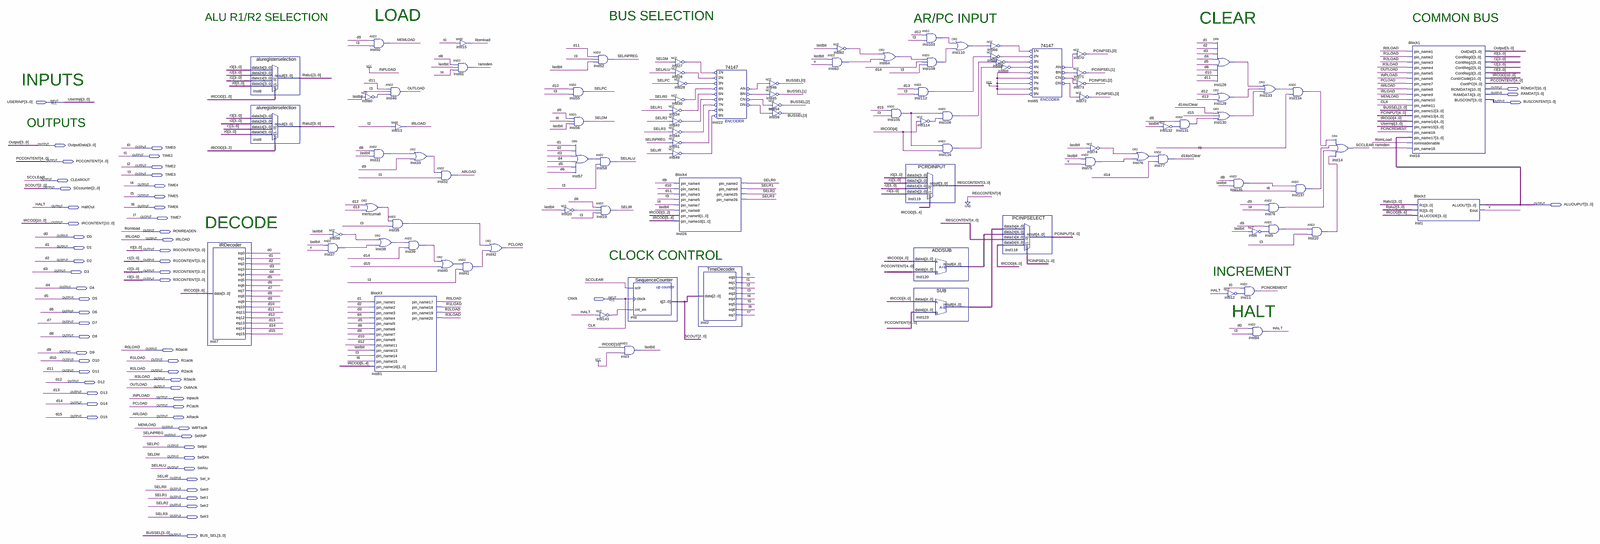
[diagram p0: schematic sheet, whole]
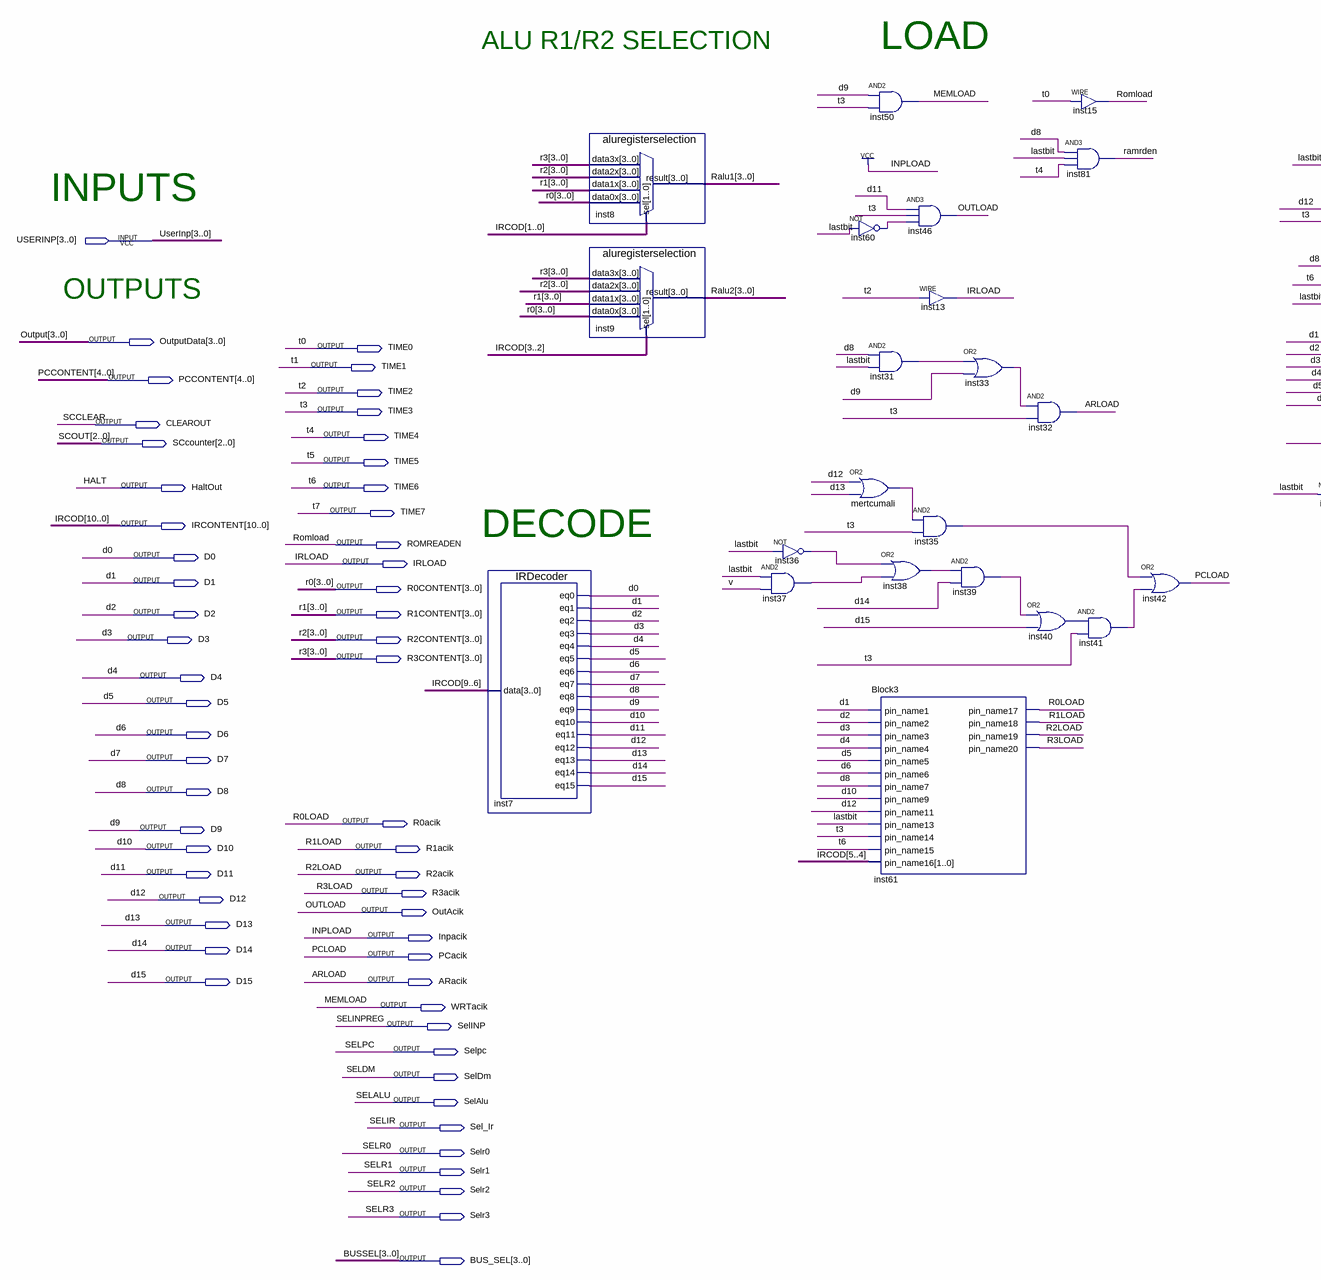
[diagram p1: schematic sheet, left part]
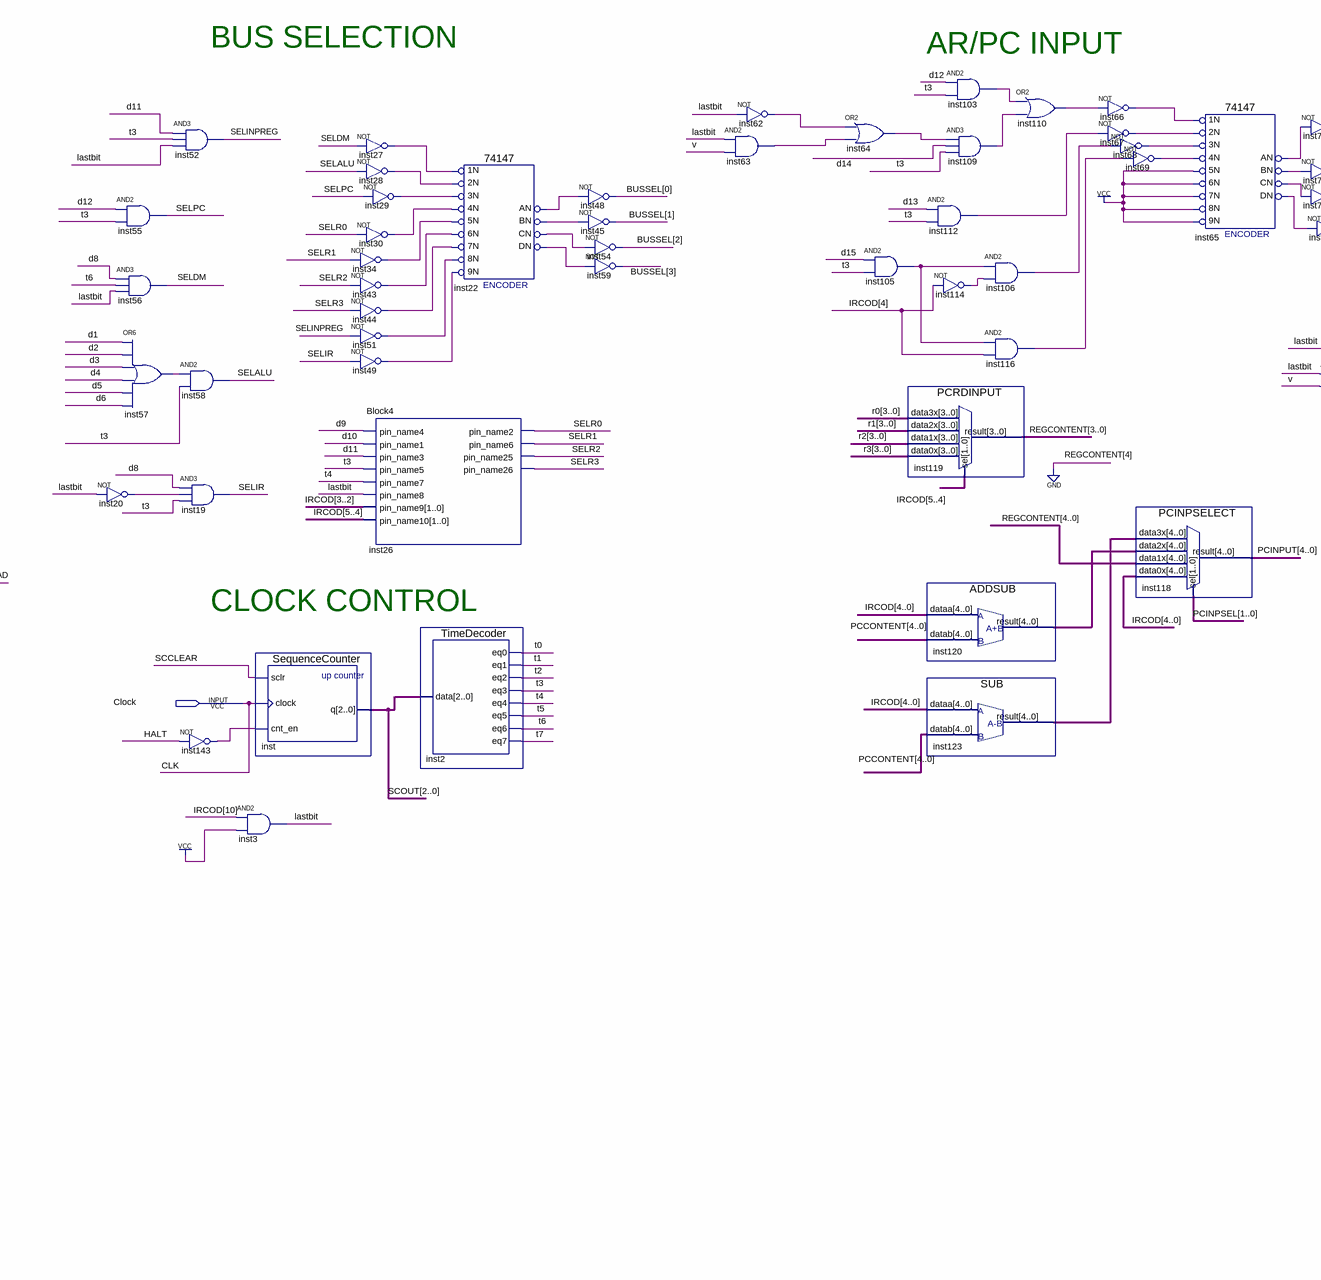
[diagram p2: schematic sheet, centre part]
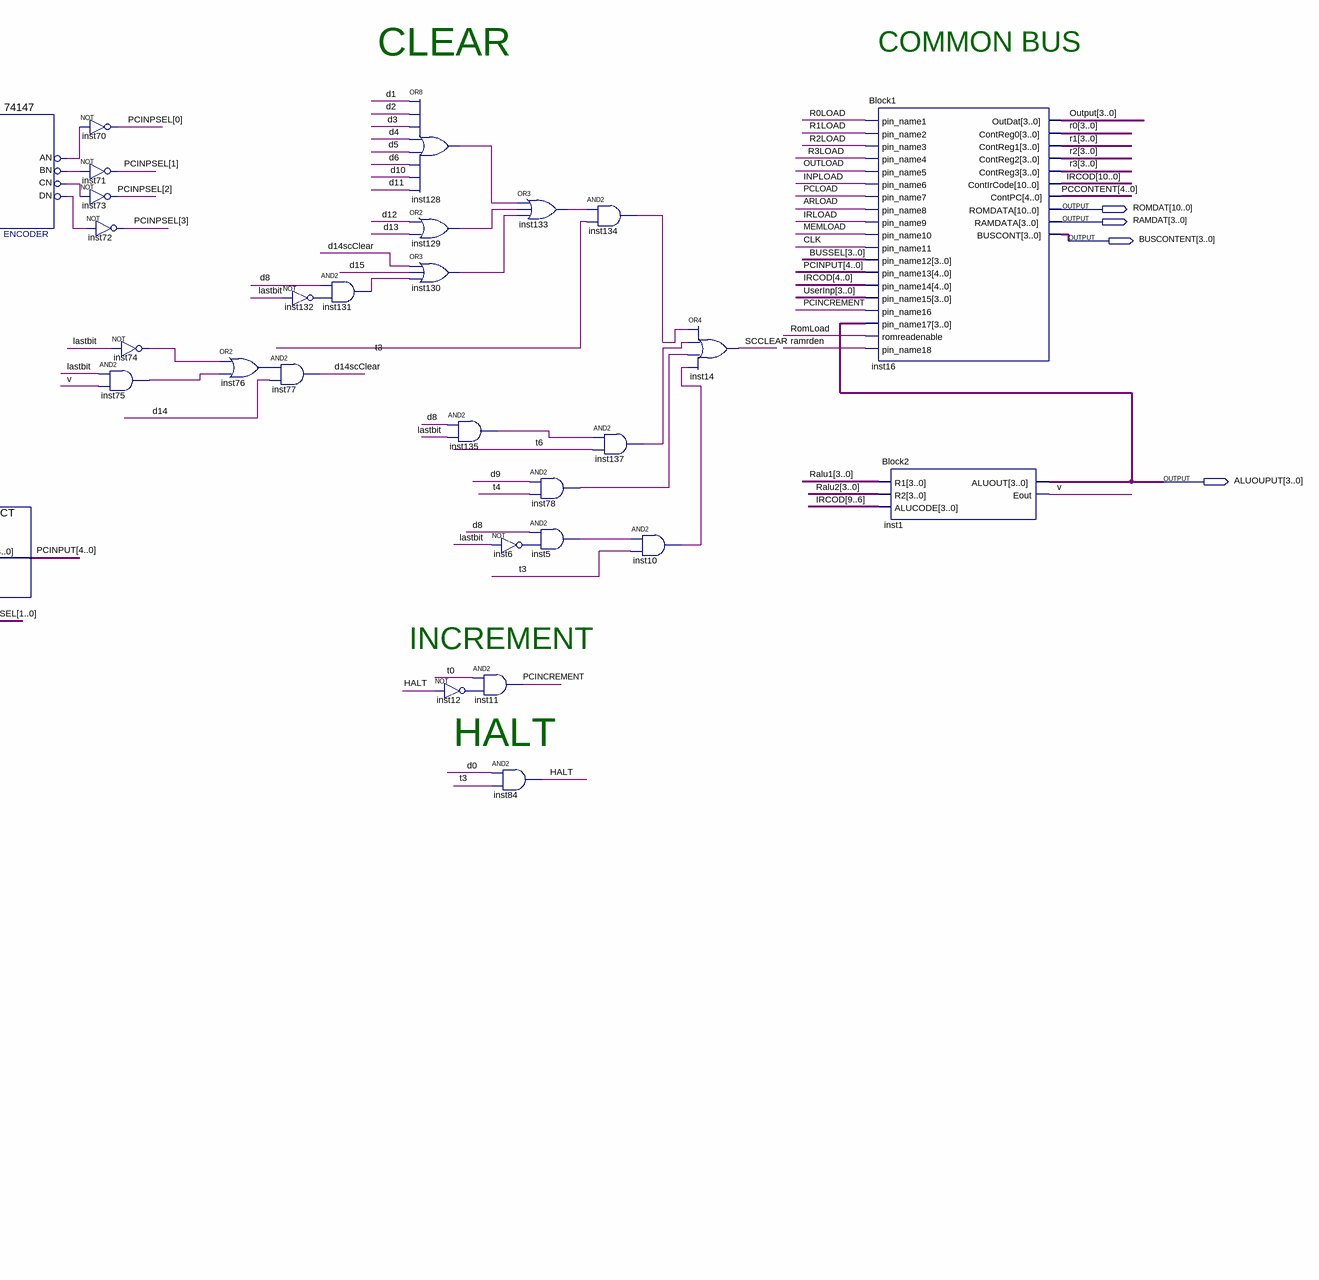
[diagram p3: schematic sheet, right part]
// Quartus schematic ControlUnit.bdf as structural Verilog: 95 symbols, 61 pins
module ControlUnit (
  input  [3:0] USERINP,
  input  Clock,
  output [10:0] ROMDAT,
  output [3:0] RAMDAT,
  output [3:0] BUSCONTENT,
  output [3:0] OutputData,
  output TIME0,
  output TIME1,
  output [4:0] PCCONTENT,
  output TIME2,
  output TIME3,
  output CLEAROUT,
  output TIME4,
  output [2:0] SCcounter,
  output TIME5,
  output [3:0] ALUOUPUT,
  output HaltOut,
  output TIME6,
  output TIME7,
  output [10:0] IRCONTENT,
  output ROMREADEN,
  output D0,
  output IRLOAD,
  output D1,
  output [3:0] R0CONTENT,
  output D2,
  output [3:0] R1CONTENT,
  output D3,
  output [3:0] R2CONTENT,
  output [3:0] R3CONTENT,
  output D4,
  output D5,
  output D6,
  output D7,
  output D8,
  output R0acik,
  output D9,
  output D10,
  output R1acik,
  output D11,
  output R2acik,
  output R3acik,
  output D12,
  output OutAcik,
  output D13,
  output Inpacik,
  output D14,
  output PCacik,
  output D15,
  output ARacik,
  output WRTacik,
  output SelINP,
  output Selpc,
  output SelDm,
  output SelAlu,
  output Sel_Ir,
  output Selr0,
  output Selr1,
  output Selr2,
  output Selr3,
  output [3:0] BUS_SEL
);

  wire d14scClear, inst5_out, inst6_out, inst10_out, inst12_out, inst20_out, inst22_an, inst22_bn, inst22_cn,
       inst22_dn, inst27_out, inst28_out, inst29_out, inst30_out, inst31_out, inst33_out, inst34_out,
       inst35_out, inst36_out, inst37_out, inst38_out, inst39_out, inst40_out, inst41_out, inst43_out,
       inst44_out, inst49_out, inst51_out, inst57_out, inst60_out, inst62_out, inst63_out, inst64_out,
       inst65_an, inst65_bn, inst65_cn, inst65_dn, inst66_out, inst67_out, inst68_out, inst69_out,
       inst74_out, inst75_out, inst76_out, inst78_out, inst103_out, inst105_out, inst106_out, inst109_out,
       inst110_out, inst112_out, inst114_out, inst116_out, inst128_out, inst129_out, inst130_out,
       inst131_out, inst132_out, inst133_out, inst134_out, inst135_out, inst137_out, inst143_out, lastbit,
       mertcumali_out, PCINCREMENT, ramrden, v;
  wire [3:0] PCINPSEL, Ralu1, Ralu2, REGCONTENT;
  wire [4:0] inst120_result, inst123_result, PCINPUT;

  IRDecoder inst7 (
    .data(IRCONTENT[9:6]), .eq0(D0), .eq1(D1), .eq2(D2), .eq3(D3), .eq4(D4), .eq5(D5), .eq6(D6), .eq7(D7),
    .eq8(D8), .eq9(D9), .eq10(D10), .eq11(D11), .eq12(D12), .eq13(D13), .eq14(D14), .eq15(D15));
  aluregisterselection inst8 (
    .data3x(R3CONTENT), .data2x(R2CONTENT), .data1x(R1CONTENT), .data0x(R0CONTENT), .sel(IRCONTENT[1:0]),
    .result(Ralu1));
  aluregisterselection inst9 (
    .data3x(R3CONTENT), .data2x(R2CONTENT), .data1x(R1CONTENT), .data0x(R0CONTENT), .sel(IRCONTENT[3:2]),
    .result(Ralu2));
  not inst36 (inst36_out, lastbit);
  and inst37 (inst37_out, lastbit, v);
  and inst50 (WRTacik, D9, TIME3);
  not inst60 (inst60_out, lastbit);
  and inst31 (inst31_out, D8, lastbit);
  or mertcumali (mertcumali_out, D12, D13);
  or inst38 (inst38_out, inst36_out, inst37_out);
  Block3 inst61 (
    .pin_name1(D1), .pin_name2(D2), .pin_name3(D3), .pin_name4(D4), .pin_name5(D5), .pin_name6(D6),
    .pin_name7(D8), .pin_name9(D10), .pin_name11(D12), .pin_name13(lastbit), .pin_name14(TIME3),
    .pin_name15(TIME6), .pin_name16(IRCONTENT[5:4]), .pin_name17(R0acik), .pin_name18(R1acik),
    .pin_name19(R2acik), .pin_name20(R3acik));
  and inst46 (OutAcik, D11, TIME3, inst60_out);
  assign IRLOAD = TIME2;  // WIRE inst13
  and inst35 (inst35_out, mertcumali_out, TIME3);
  or inst33 (inst33_out, inst31_out, D9);
  and inst39 (inst39_out, inst38_out, D14);
  and inst32 (ARacik, inst33_out, TIME3);
  or inst40 (inst40_out, inst39_out, D15);
  assign ROMREADEN = TIME0;  // WIRE inst15
  and inst81 (ramrden, D8, lastbit, TIME4);
  and inst41 (inst41_out, inst40_out, TIME3);
  or inst42 (PCacik, inst35_out, inst41_out);
  and inst55 (Selpc, D12, TIME3);
  and inst56 (SelDm, D8, TIME6, lastbit);
  not inst20 (inst20_out, lastbit);
  or inst57 (inst57_out, D1, D2, D3, D4, D5, D6);
  and inst52 (SelINP, D11, TIME3, lastbit);
  and inst58 (SelAlu, inst57_out, TIME3);
  and inst19 (Sel_Ir, D8, inst20_out, TIME3);
  not inst143 (inst143_out, HaltOut);
  SequenceCounter inst (.sclr(CLEAROUT), .clock(Clock), .cnt_en(inst143_out), .q(SCcounter));
  and inst3 (lastbit, IRCONTENT[10], 1'b1);
  not inst27 (inst27_out, SelDm);
  not inst28 (inst28_out, SelAlu);
  not inst29 (inst29_out, Selpc);
  not inst30 (inst30_out, Selr0);
  not inst34 (inst34_out, Selr1);
  not inst43 (inst43_out, Selr2);
  not inst44 (inst44_out, Selr3);
  not inst51 (inst51_out, SelINP);
  not inst49 (inst49_out, Sel_Ir);
  Block4 inst26 (
    .pin_name4(D9), .pin_name1(D10), .pin_name3(D11), .pin_name5(TIME3), .pin_name7(TIME4),
    .pin_name8(lastbit), .pin_name9(IRCONTENT[3:2]), .pin_name10(IRCONTENT[5:4]), .pin_name2(Selr0),
    .pin_name6(Selr1), .pin_name25(Selr2), .pin_name26(Selr3));
  TimeDecoder inst2 (
    .data(SCcounter), .eq0(TIME0), .eq1(TIME1), .eq2(TIME2), .eq3(TIME3), .eq4(TIME4), .eq5(TIME5),
    .eq6(TIME6), .eq7(TIME7));
  \74147  inst22 (
    .\1N (inst27_out), .\2N (inst28_out), .\3N (inst29_out), .\6N (inst43_out), .\5N (inst34_out),
    .\4N (inst30_out), .\9N (inst49_out), .\8N (inst51_out), .\7N (inst44_out), .CN(inst22_cn),
    .BN(inst22_bn), .AN(inst22_an), .DN(inst22_dn));
  not inst48 (BUS_SEL[0], inst22_an);
  not inst45 (BUS_SEL[1], inst22_bn);
  not inst54 (BUS_SEL[2], inst22_cn);
  not inst59 (BUS_SEL[3], inst22_dn);
  and inst63 (inst63_out, lastbit, v);
  not inst62 (inst62_out, lastbit);
  or inst64 (inst64_out, inst62_out, inst63_out);
  and inst105 (inst105_out, D15, TIME3);
  and inst112 (inst112_out, D13, TIME3);
  PCRDINPUT inst119 (
    .data3x(R0CONTENT), .data2x(R1CONTENT), .data1x(R2CONTENT), .data0x(R3CONTENT), .sel(IRCONTENT[5:4]),
    .result(REGCONTENT));
  ADDSUB inst120 (.dataa(IRCONTENT[4:0]), .datab(PCCONTENT), .result(inst120_result));
  SUB inst123 (.dataa(IRCONTENT[4:0]), .datab(PCCONTENT), .result(inst123_result));
  and inst103 (inst103_out, D12, TIME3);
  and inst109 (inst109_out, inst64_out, D14, TIME3);
  not inst114 (inst114_out, IRCONTENT[4]);
  or inst110 (inst110_out, inst103_out, inst109_out);
  and inst106 (inst106_out, inst105_out, inst114_out);
  and inst116 (inst116_out, inst105_out, IRCONTENT[4]);
  not inst66 (inst66_out, inst110_out);
  not inst67 (inst67_out, inst112_out);
  not inst68 (inst68_out, inst106_out);
  not inst69 (inst69_out, inst116_out);
  PCINPSELECT inst118 (
    .data3x(inst123_result), .data2x(inst120_result), .data1x({1'b0, REGCONTENT}), .data0x(IRCONTENT[4:0]),
    .sel(PCINPSEL[1:0]), .result(PCINPUT));
  \74147  inst65 (
    .\1N (inst66_out), .\2N (inst67_out), .\3N (inst68_out), .\6N (1'b1), .\5N (1'b1), .\4N (inst69_out),
    .\9N (1'b1), .\8N (1'b1), .\7N (1'b1), .CN(inst65_cn), .BN(inst65_bn), .AN(inst65_an), .DN(inst65_dn));
  not inst70 (PCINPSEL[0], inst65_an);
  not inst71 (PCINPSEL[1], inst65_bn);
  not inst73 (PCINPSEL[2], inst65_cn);
  not inst72 (PCINPSEL[3], inst65_dn);
  not inst74 (inst74_out, lastbit);
  and inst75 (inst75_out, lastbit, v);
  or inst76 (inst76_out, inst74_out, inst75_out);
  not inst132 (inst132_out, lastbit);
  and inst77 (d14scClear, inst76_out, D14);
  and inst131 (inst131_out, D8, inst132_out);
  or inst128 (inst128_out, D1, D2, D3, D4, D5, D6, D10, D11);
  or inst129 (inst129_out, D12, D13);
  or inst130 (inst130_out, d14scClear, D15, inst131_out);
  and inst135 (inst135_out, D8, lastbit);
  not inst12 (inst12_out, HaltOut);
  or inst133 (inst133_out, inst128_out, inst129_out, inst130_out);
  not inst6 (inst6_out, lastbit);
  and inst11 (PCINCREMENT, TIME0, inst12_out);
  and inst84 (HaltOut, D0, TIME3);
  and inst78 (inst78_out, D9, TIME4);
  and inst5 (inst5_out, D8, inst6_out);
  and inst134 (inst134_out, inst133_out, TIME3);
  and inst137 (inst137_out, inst135_out, TIME6);
  and inst10 (inst10_out, inst5_out, TIME3);
  or inst14 (CLEAROUT, inst134_out, inst137_out, inst78_out, inst10_out);
  Block1 inst16 (
    .pin_name1(R0acik), .pin_name2(R1acik), .pin_name3(R2acik), .pin_name4(R3acik), .pin_name5(OutAcik),
    .pin_name6(1'b1), .pin_name7(PCacik), .pin_name8(ARacik), .pin_name9(IRLOAD), .pin_name10(WRTacik),
    .pin_name11(Clock), .pin_name12(BUS_SEL), .pin_name13(PCINPUT), .pin_name14(IRCONTENT[4:0]),
    .pin_name15(USERINP), .pin_name16(PCINCREMENT), .pin_name17(ALUOUPUT), .romreadenable(ROMREADEN),
    .pin_name18(ramrden), .OutDat(OutputData), .ContReg0(R0CONTENT), .ContReg1(R1CONTENT),
    .ContReg2(R2CONTENT), .ContReg3(R3CONTENT), .ContIrCode(IRCONTENT), .ContPC(PCCONTENT), .ROMDATA(ROMDAT),
    .RAMDATA(RAMDAT), .BUSCONT(BUSCONTENT));
  Block2 inst1 (.R1(Ralu1), .R2(Ralu2), .ALUCODE(IRCONTENT[9:6]), .ALUOUT(ALUOUPUT), .Eout(v));

  assign Inpacik = 1'b1;

  // Other names for the same wires on the sheet: ARLOAD = ARacik; BUSSEL[3:0] = BUS_SEL; CLK = Clock; HALT = HaltOut;
  //   IRCOD[10:0] = IRCONTENT; MEMLOAD = WRTacik; OUTLOAD = OutAcik; Output[3:0] = OutputData; PCLOAD = PCacik;
  //   r0[3:0] = R0CONTENT; R0LOAD = R0acik; r1[3:0] = R1CONTENT; R1LOAD = R1acik; r2[3:0] = R2CONTENT;
  //   R2LOAD = R2acik; r3[3:0] = R3CONTENT; R3LOAD = R3acik; Romload = ROMREADEN; SCCLEAR = CLEAROUT;
  //   SCOUT[2:0] = SCcounter; SELINPREG = SelINP; SELIR = Sel_Ir; t0 = TIME0; t1 = TIME1; t2 = TIME2; t3 = TIME3;
  //   t4 = TIME4; t5 = TIME5; t6 = TIME6; t7 = TIME7

  // Notes on the sheet:
  //   LOAD
  //   BUS SELECTION
  //   CLEAR
  //   ALU R1/R2 SELECTION
  //   AR/PC INPUT 
  //   COMMON BUS
  //   INPUTS
  //   OUTPUTS
  //   DECODE
  //   CLOCK CONTROL
  //   INCREMENT
  //   HALT
endmodule
